# EAGLE design geiger_lora_edit3 (EAGLE 9.6.2)
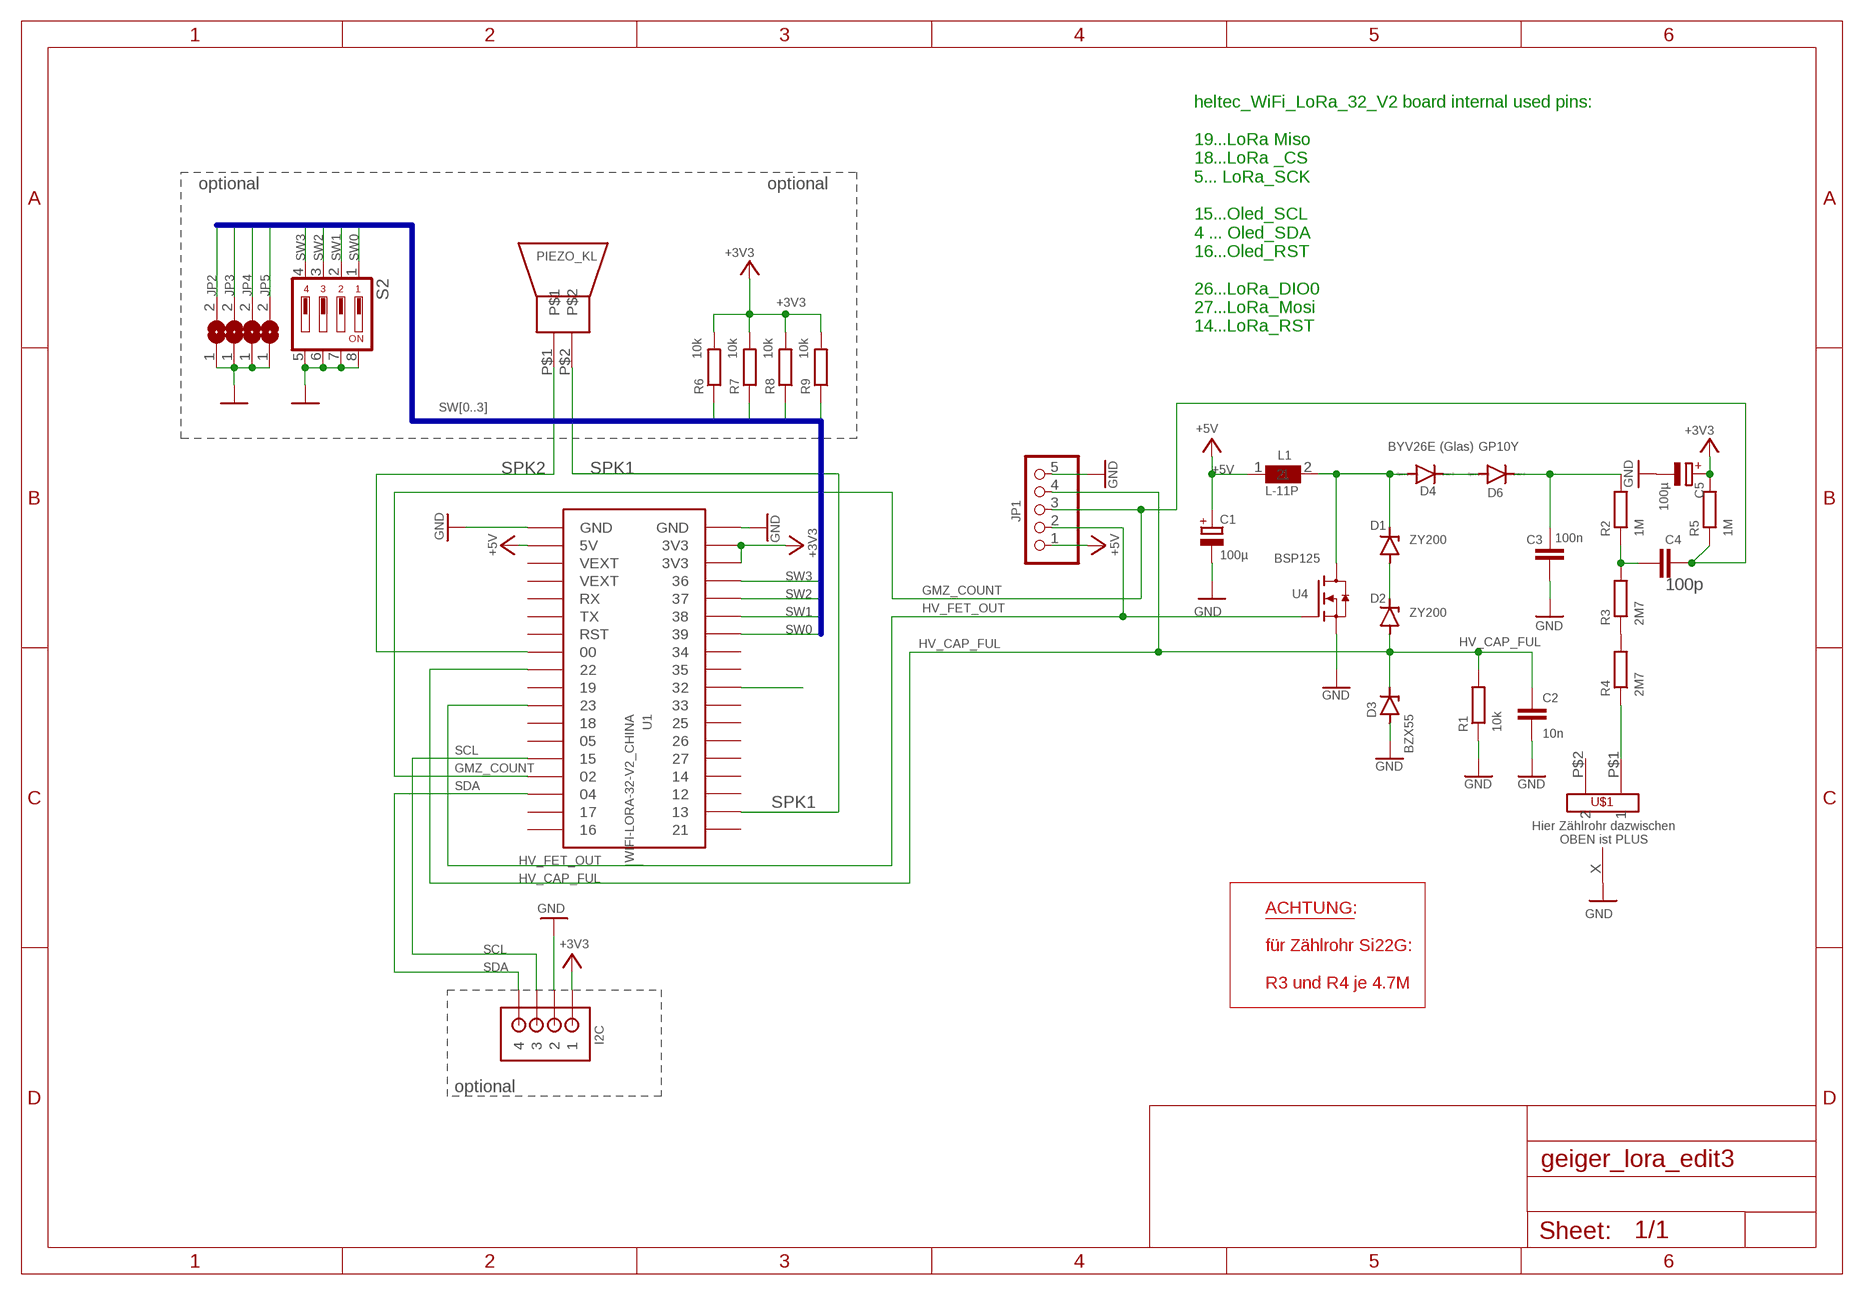
[diagram p0: schematic, sheet 1]

## Parts
C1  100µ  CPOL-EUE2-5  [E2-5]
C2  10n  C-EU050-035X075  [C050-035X075]
C3  100n  C-EU150-072X183  [C150-072X183]
C4  100p  C-EU050-045X075  [C050-045X075]
C5  100µ  CPOL-EUE2-5  [E2-5]
D1  ZY200  ZENER-DIODEDO41Z10  [DO41Z10]
D2  ZY200  ZENER-DIODEDO41Z10  [DO41Z10]
D3  BZX55  [DO35Z10]
D4  BYV26E (Glas)  1N4004  [DO41-10]
D6  GP10Y  1N4004  [DO41-10]
I2C  B4B-ZRSIDE_ENTRY  [S4B-ZR]
JP1  PINHD-1X5  [1X05]
JP2  Jumper  SJ  [SJ]
JP3  SJ  [SJ]
JP4  SJ  [SJ]
JP5  SJ  [SJ]
L1  L-11P  [L-11P]
PIEZO_KL  PIEPSER  [PIEPSER]
R1  10k  R-EU_0207/10  [0207/10]
R2  1M  R-EU_0207/10  [0207/10]
R3  2M7  R-EU_0207/10  [0207/10]
R4  2M7  R-EU_0207/10  [0207/10]
R5  1M  R-EU_0207/10  [0207/10]
R6  10k  R-EU_M0805  [M0805]
R7  10k  R-EU_M0805  [M0805]
R8  10k  R-EU_M0805  [M0805]
R9  10k  R-EU_M0805  [M0805]
S2  DIP04YL  [DIP04YL]
U1  WIFI-LORA-32-V2_CHINA  [2.54MM_2X18_CHINA]
U4  BSP125  [SOT223]
U$1  FUSE_HOLDER  [FUSE_HOLDER]
U$5  ONE_PAD  [ONE_PAD]

## Nets
+3V3: C5.+ I2C.1 R5.2 R6.2 R7.2 R8.2 R9.2 U1.P$34(3V3) U1.P$35(3V3)
+5V: C1.+ JP1.1 L1.1 U1.P$2(5V)
GMZ_COUNT: C4.2 JP1.3 R5.1 U1.P$15
GND: C1.- C2.2 C3.2 C5.- D3.A I2C.2 JP1.5 JP2.1 JP3.1 JP4.1 JP5.1 R1.1 S2.5 S2.6 S2.7 S2.8 U1.P$1(GND) U1.P$36(GND) U4.3(S) U$5.X
HV_CAP_FUL: C2.1 D2.A D3.C JP1.4 R1.2 U1.P$9
HV_FET_OUT: JP1.2 U1.P$11 U4.1(G)
N$2: D1.A D2.C
N$3: D1.C D4.A L1.2 U4.2(D) U4.4(D)
N$4: C3.1 D6.C R2.2
N$5: R4.1 U$1.P$1
N$6: R3.1 R4.2
N$7: C4.1 R2.1 R3.2
N$9: D4.C D6.A
N$10: U1.P$27
SCL: I2C.3 U1.P$14
SDA: I2C.4 U1.P$16
SPK1: PIEZO_KL.P$2 U1.P$20
SPK2: PIEZO_KL.P$1 U1.P$8
SW0: JP5.2 R6.1 S2.1 U1.P$30
SW1: JP4.2 R7.1 S2.2 U1.P$31
SW2: JP3.2 R8.1 S2.3 U1.P$32
SW3: JP2.2 R9.1 S2.4 U1.P$33
Unconnected: U1.P$3(VEXT) U1.P$4(VEXT) U1.P$5(RX) U1.P$6(TX) U1.P$7(RST) U1.P$10 U1.P$12 U1.P$13 U1.P$17 U1.P$18 U1.P$19 U1.P$21 U1.P$22 U1.P$23 U1.P$24 U1.P$25 U1.P$26 U1.P$28 U1.P$29 U$1.P$2

## Buses
SW[0..3]

## Notes on the sheet
- optional | optional
- heltec_WiFi_LoRa_32_V2 board internal used pins:
  
  19...LoRa Miso
  18...LoRa _CS
  5... LoRa_SCK
  
  15...Oled_SCL
  4 ... Oled_SDA
  16...Oled_RST
  
  26...LoRa_DIO0
  27...LoRa_Mosi
  14...LoRa_RST
- Hier Zählrohr dazwischen
          OBEN ist PLUS
- ACHTUNG:
  
  für Zählrohr Si22G:
  
  R3 und R4 je 4.7M
- optional

## Library data of the parts
C1 C5 = rcl:CPOL-EU: POLARIZED CAPACITOR, European symbol; SPICEPREFIX: C
C2-C4 = rcl:C-EU: CAPACITOR, European symbol; SPICEPREFIX: C
D1 D2 = diode:ZENER-DIODE: Z-Diode
D3 = tlc5940:BZX55: Z DIODE
D4 D6 = diode:1N4004: DIODE general purpose rectifier, 1 A
I2C = jst:B4B-ZR: JST-ZH Connector 4 pol, 1.5mm pitch Package: B4B-ZR Source: http://www.jst-mfg.com/product/pdf/eng/eZH.pdf
JP1 = pinhead:PINHD-1X5: PIN HEADER
JP2-JP5 = jumper:SJ: SMD solder JUMPER
L1 = tlc5940:L-11P
PIEZO_KL = tlc5940:PIEPSER
R1-R9 = rcl:R-EU_: RESISTOR, European symbol; SPICEPREFIX: R
S2 = switch-dil:DIP04YL: DIL/CODE SWITCH; OC_FARNELL: unknown; OC_NEWARK: unknown
U1 = ESP32_modules:WIFI-LORA-32-V2_CHINA
U4 = tlc5940:BSP125
U$1 = tlc5940:FUSE_HOLDER
U$5 = tlc5940:ONE_PAD

## Net classes
0 default: clearance 0.205 mm

## Board
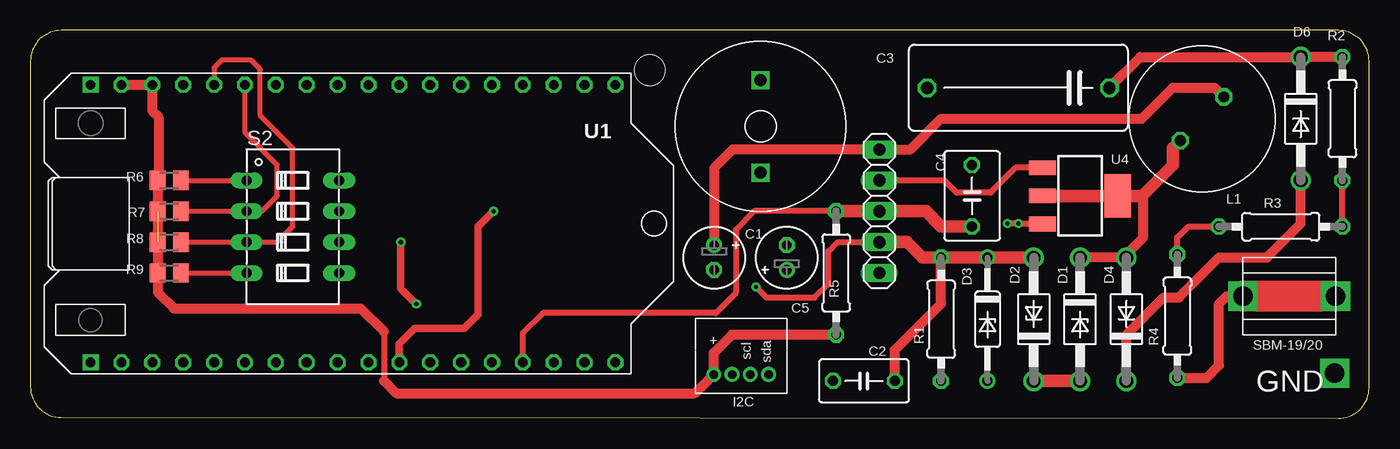
[diagram p1: board, top side]
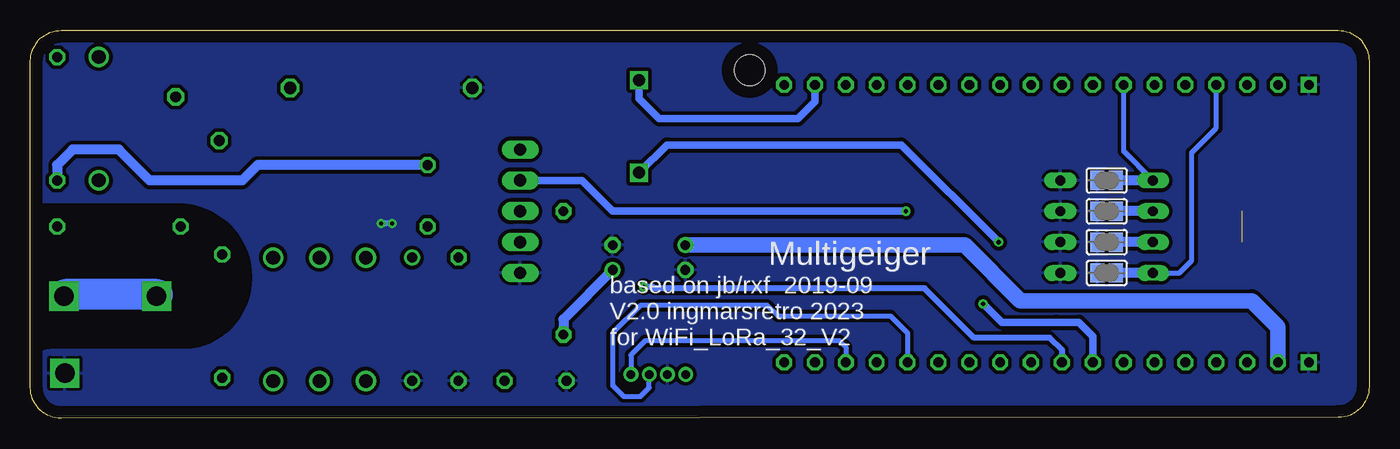
[diagram p2: board, bottom side, seen from below]

Size 110.14 x 31.94 mm. Coordinates in mm from the lower left corner, seen from the top.
Outline: 0,29.4 0,2.61 arc90 2.54,0.07 107.6,0 arc90 110.14,2.54 110.14,29.4 arc90 107.6,31.94 2.54,31.94 arc90 0,29.4
Copper layers (1*16): Top 0.035mm / dielectric 1.5mm / Bottom 0.035mm
Design rules "default": minimum track width 6mil, minimum drill 0.35mm, track to track 6mil, track to pad 6mil, pad to pad 6mil, via to via 6mil, smd to smd 6mil, copper to edge 40mil, drill to drill 6mil, minimum pad ring 10mil, minimum via ring 8mil, stop-mask expansion 4mil, vias tented up to drill 0mil, thermal gap 10mil
Holes 2.5 mm at 50.96,28.66

### Footprints (pad centres in the part's own frame; a part is rotated, then mirrored left to right if it is on the bottom)
E2-5 = drill 0.813 pad 1.27: + -1.016,0 | drill 0.813 pad 1.27 octagon: - 1.016,0
C050-035X075 = drill 0.813 octagon: 1 -2.54,0; 2 2.54,0
C150-072X183 = drill 1.016 octagon: 1 -7.493,0; 2 7.493,0
C050-045X075 = drill 0.813 octagon: 1 -2.54,0; 2 2.54,0
DO41Z10 = drill 1.118: A 5.08,0; C -5.08,0
DO35Z10 = drill 0.813: A 5.08,0; C -5.08,0
DO41-10 = drill 1.118: A 5.08,0; C -5.08,0
S4B-ZR = drill 0.7: 1 6,2; 2 4.5,2; 3 3,2; 4 1.5,2
1X05 = drill 1.016 long: 1 -5.08,0; 2 -2.54,0; 3 0,0; 4 2.54,0; 5 5.08,0
SJ = smd 1.168 x 1.6: 1 -0.762,0; 2 0.762,0
L-11P = drill 0.9 octagon: 1 -2.54,0; 2 2.54,0
PIEPSER = drill 1 square: P$1 -3.81,0; P$2 3.81,0
0207/10 = drill 0.813 octagon: 1 -5.08,0; 2 5.08,0
M0805 = smd 1.3 x 1.6: 1 -0.95,0; 2 0.95,0
DIP04YL = drill 0.813 long: 1 -3.81,-3.81; 2 -1.27,-3.81; 3 1.27,-3.81; 4 3.81,-3.81; 5 3.81,3.81; 6 1.27,3.81; 7 -1.27,3.81; 8 -3.81,3.81
2.54MM_2X18_CHINA = drill 0.8 square: P$1 -20.32,-11.43; P$36 -20.32,11.43 | drill 0.8 octagon: P$2 -17.78,-11.43; P$3 -15.24,-11.43; P$4 -12.7,-11.43; P$5 -10.16,-11.43; P$6 -7.62,-11.43; P$7 -5.08,-11.43; P$8 -2.54,-11.43; P$9 0,-11.43; P$10 2.54,-11.43; P$11 5.08,-11.43; P$12 7.62,-11.43; P$13 10.16,-11.43; P$14 12.7,-11.43; P$15 15.24,-11.43; P$16 17.78,-11.43; P$17 20.32,-11.43; P$18 22.86,-11.43; P$19 22.86,11.43; P$20 20.32,11.43; P$21 17.78,11.43; P$22 15.24,11.43; P$23 12.7,11.43; P$24 10.16,11.43; P$25 7.62,11.43; P$26 5.08,11.43; P$27 2.54,11.43; P$28 0,11.43; P$29 -2.54,11.43; P$30 -5.08,11.43; P$31 -7.62,11.43; P$32 -10.16,11.43; P$33 -12.7,11.43; P$34 -15.24,11.43; P$35 -17.78,11.43
SOT223 = smd 1.219 x 2.235: 1 -2.311,-3.099; 2 0,-3.099; 3 2.311,-3.099 | smd 3.6 x 2.2: 4 0,3.099
FUSE_HOLDER = drill 1.6 square: P$1 -3.81,0.635; P$2 3.81,0.635
ONE_PAD = drill 1.6 square: X 0,0

### Placement (x,y rotation side)
C1  56.26,13.24 270 top
C2  68.58,3.08 180 top
C3  81.28,27.21 180 top
C4  77.47,18.32 270 top
C5  62.23,13.24 90 top
D1  86.36,8.16 270 top
D2  82.55,8.16 90 top
D3  78.74,8.16 270 top
D4  90.17,8.16 90 top
D6  104.52,24.67 270 top
I2C  62.23,5.62 180 top
JP1  69.85,17.05 270 top
JP2  21.59,11.97 0 bottom
JP3  21.59,14.51 0 bottom
JP4  21.59,17.05 0 bottom
JP5  21.59,19.59 0 bottom
L1  96.39,24.67 225 top
PIEZO_KL  60.07,24.03 90 top
R1  74.93,8.16 90 top
R2  107.95,24.67 90 top
R3  102.87,15.78 0 top
R4  94.36,8.41 90 top
R5  66.29,11.97 270 top
R6  11.43,19.59 180 top
R7  11.43,17.05 180 top
R8  11.43,14.51 180 top
R9  11.43,11.97 180 top
S2  21.59,15.78 270 top
U1  25.27,16.03 0 top
U4  86.36,18.32 270 top
U$1  103.57,9.43 0 top
U$5  107.31,3.71 0 top

### Tracks (layer width: path | path; a pad name or v marks a point on that pad's centre or on a via)
+3V3  (1 unrouted)
  Top 0.508: 29.08,7.14 29.08,3.08
  Top 0.813: U1.P$35 U1.P$34 10.03,25.3 10.54,24.79 10.54,19.65 R6.2 R7.2 R9.2 10.48,10.38 11.81,9.05 27.18,9.05 29.08,7.14 | R5.2 57.72,6.89 56.23,5.39 I2C.1 54.67,2.06 30.1,2.06 29.08,3.08
  Bottom 0.813: R5.2 66.29,8.16 C5.+
+5V
  Top 0.813: L1.1 97.44,27.21 93.98,27.21 91.44,24.67 74.93,24.67 72.39,22.13 JP1.1 57.78,22.13 56.26,20.6 C1.+
  Bottom 1.27: C1.+ 33.27,14.25 28.7,9.68 9.65,9.68 7.49,7.52 U1.P$2
GMZ_COUNT
  Top 0.508: R5.1 59.56,17.05 58.04,15.52 58.04,10.32 56.39,8.66 42.16,8.66 40.51,7.01 U1.P$15
  Top 1.016: C4.2 74.93,15.78 73.66,17.05 JP1.3 R5.1
GND  (via drill 0.35)
  Top 0.508: U4.3 81.31,16.01 v81.28,16.03 v80.39,16.03
  Bottom 0.508: v80.39,16.03 v81.28,16.03
  pour Bottom (isolate 0.305): 110.49,3.29 110.49,1.81 arc-90 107.95,-0.73 2.54,-0.73 arc-90 0,1.81 0,29.75 arc-90 2.54,32.29 107.95,32.29 arc-90 110.49,29.75 110.49,19.06 arc-90 109.22,17.79 97.99,17.79 arc135 93.62,7.25 arc45 97.56,5.62 108.48,5.62 arc-45 109.75,5.09 arc-45
HV_CAP_FUL  (via drill 0.35)
  Top 0.508: v59.69,10.82 60.58,9.93 64.52,9.93 65.66,11.08 65.66,13.74 66.42,14.51 JP1.4
  Top 0.813: R1.2 74.93,9.43 71.12,5.62 C2.1
  Top 1.016: D2.A D3.C R1.2 73.41,13.24 72.14,14.51 JP1.4
  Bottom 0.508: U1.P$9 25.27,5.62 26.29,6.63 32.51,6.63 36.58,10.7 58.8,10.7 58.93,10.82 v59.69,10.82
HV_FET_OUT  (via drill 0.35)
  Top 0.508: U4.1 81.05,20.63 78.99,18.57 76.2,18.57 75.18,19.59 JP1.2
  Top 0.61: v38.1,17.05 36.83,15.78 36.83,8.54 35.69,7.39 31.62,7.39 30.35,6.12 U1.P$11
  Bottom 0.61: JP1.2 64.77,19.59 62.23,17.05 v38.1,17.05
N$1
  Bottom 2.54: 99.69,10.19 107.31,10.19
N$2
  Top 1.016: D2.C D1.A
N$3
  Top 0.813: D1.C D4.A 90.17,13.49 91.57,14.89 91.57,18.19 91.44,18.32
  Top 1.016: U4.2 U4.4 91.44,18.32 93.98,20.86 93.98,22.25 L1.2
N$4
  Top 0.813: R2.2 D6.C 91.31,29.75 C3.1
N$5
  Top 0.813: R4.1 96.77,3.33 97.79,4.35 97.79,9.43 98.42,10.06 99.69,10.06 U$1.P$1
  Top 2.54: 99.69,10.06 107.19,10.06
N$6
  Top 0.508: R4.2 94.36,14.89 95.25,15.78 R3.1
N$7
  Top 0.508: R3.2 R2.1
  Bottom 0.813: C4.1 91.44,20.86 92.71,19.59 100.33,19.59 102.87,22.13 106.68,22.13 107.95,20.86 R2.1
N$9
  Top 0.813: D4.C 90.17,6.89 93.22,9.93 94.49,9.93 97.79,13.24 101.73,13.24 104.52,16.03 D6.A
SCL
  Bottom 0.406: I2C.3 59.23,2.52 59.94,1.81 61.34,1.81 62.23,2.7 62.23,7.01 59.94,9.3 49.53,9.3 48.64,8.41 39.37,8.41 37.97,7.01 U1.P$14
SDA
  Bottom 0.406: I2C.4 60.73,5.21 59.56,6.38 43.56,6.38 43.05,5.87 U1.P$16
SPK1
  Bottom 0.61: PIEZO_KL.P$2 60.07,26.32 58.42,24.67 46.99,24.67 45.59,26.06 U1.P$20
SPK2  (via drill 0.35)
  Top 0.61: v30.48,14.51 30.48,10.7 v31.75,9.43
  Bottom 0.61: PIEZO_KL.P$1 57.78,22.51 38.48,22.51 v30.48,14.51 | v31.75,9.43 30.23,7.9 25.72,7.9 23.88,7.9 22.73,6.76 U1.P$8
SW0  (1 unrouted)
  Top 0.406: R6.1 S2.1
  Bottom 0.406: 18.67,19.59 S2.1 20.19,22 U1.P$30
  Bottom 0.813: 18.67,19.59 20.77,19.59
SW1  (1 unrouted)
  Top 0.406: R7.1 S2.2 19.05,17.05 20.32,18.32 20.32,20.86 17.65,23.52 U1.P$31
  Bottom 0.813: S2.2 20.77,17.05
SW2  (1 unrouted)
  Top 0.406: R8.1 S2.3 20.32,14.51 21.59,15.78 21.59,22.25 18.92,24.92 18.92,28.73 18.16,29.49 15.75,29.49 15.11,28.86 U1.P$32
  Bottom 0.813: S2.3 20.77,14.51
SW3  (1 unrouted)
  Top 0.406: R9.1 S2.4
  Bottom 0.406: S2.4 15.62,11.97 14.61,12.98 14.61,21.87 12.57,23.9 U1.P$33
  Bottom 0.813: S2.4 20.77,11.97

### Text on the board
tNames: + | SBM-19/20 | scl | sda | GND
bNames: Multigeiger | based on jb/rxf 2019-09 / V2.0 ingmarsretro 2023 / for WiFi_LoRa_32_V2